# EAGLE design Sensors (EAGLE 7.3.0)
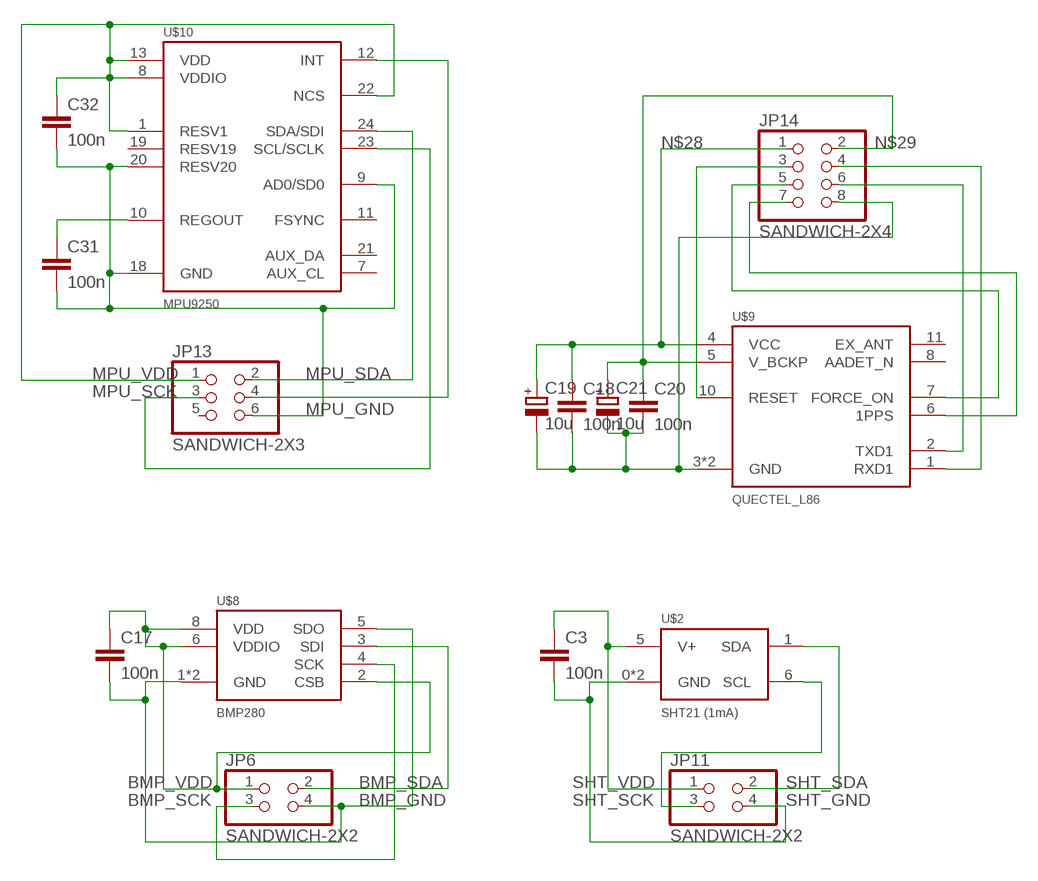
[diagram p0: schematic, sheet 1]

## Parts
C3  100n  C-EUC0805  [C0805]
C17  100n  C-EUC0805  [C0805]
C18  100n  C-EUC0805  [C0805]
C19  10u  CPOL-EUUD-4X5,8  [UD-4X5,8_NICHICON]
C20  100n  C-EUC0805  [C0805]
C21  10u  CPOL-EUUD-4X5,8  [UD-4X5,8_NICHICON]
C31  100n  C-EUC0805  [C0805]
C32  100n  C-EUC0805  [C0805]
JP6  SANDWICH-2X2  [SANDWICH-2X2]
JP11  SANDWICH-2X2  [SANDWICH-2X2]
JP13  SANDWICH-2X3  [SANDWICH-2X3]
JP14  SANDWICH-2X4  [SANDWICH-2X4]
U$2  SHT21 (1mA)  SHT21  [DFN6]
U$8  BMP280  [BMP280]
U$9  QUECTEL_L86  [QUECTEL_L86]
U$10  MPU9250  [QFN-24]

## Nets
BMP_GND: C17.2 JP6.4 U$8.1(GND) U$8.5(SDO) U$8.7(GND)
BMP_SCK: JP6.3 U$8.4(SCK)
BMP_SDA: JP6.2 U$8.3(SDI)
BMP_VDD: C17.1 JP6.1 U$8.2(CSB) U$8.6(VDDIO) U$8.8(VDD)
MPU_GND: C31.2 C32.2 JP13.6 U$10.9(AD0/SD0) U$10.18(GND) U$10.20(RESV20)
MPU_SCK: JP13.3 U$10.23(SCL/SCLK)
MPU_SDA: JP13.2 U$10.24(SDA/SDI)
MPU_VDD: C32.1 JP13.1 U$10.1(RESV1) U$10.8(VDDIO) U$10.13(VDD) U$10.22(NCS)
N$28: C18.1 C19.+ JP14.1 U$9.4(VCC)
N$29: C20.1 C21.+ JP14.2 U$9.5(V_BCKP)
N$35: C31.1 U$10.10(REGOUT)
N$36: JP13.4 U$10.12(INT)
N$37: JP14.3 U$9.10(RESET)
N$38: JP14.6 U$9.2(TXD1)
N$41: JP14.4 U$9.1(RXD1)
N$42: JP14.5 U$9.7(FORCE_ON)
N$43: JP14.7 U$9.6(1PPS)
N$44: C18.2 C19.- C20.2 C21.- JP14.8 U$9.3(GND) U$9.12(GND)
SHT_GND: C3.2 JP11.4 U$2.0(GND) U$2.2(GND)
SHT_SCK: JP11.3 U$2.6(SCL)
SHT_SDA: JP11.2 U$2.1(SDA)
SHT_VDD: C3.1 JP11.1 U$2.5(V+)
Unconnected: JP13.5 U$9.8(AADET_N) U$9.11(EX_ANT) U$10.7(AUX_CL) U$10.11(FSYNC) U$10.19(RESV19) U$10.21(AUX_DA)

## Library data of the parts
C3 C17 C18 C20 C31 C32 = rcl:C-EU: CAPACITOR, European symbol
C19 C21 = rcl:CPOL-EU: POLARIZED CAPACITOR, European symbol
JP6 JP11 = Misc:SANDWICH-2X2
JP13 = Misc:SANDWICH-2X3
JP14 = Misc:SANDWICH-2X4
U$2 = Misc:SHT21: Tempsensor RS No: 709-8868 MRF No: TMP112AIDRLT
U$8 = Misc:BMP280
U$9 = Misc:QUECTEL_L86
U$10 = Misc:MPU9250: 9-axis MotionTracking device that combines a 3-axis gyroscope, 3-axis accelerometer, 3-axis magnetometer and a Digital Motion Processor™ (DMP)

## Board
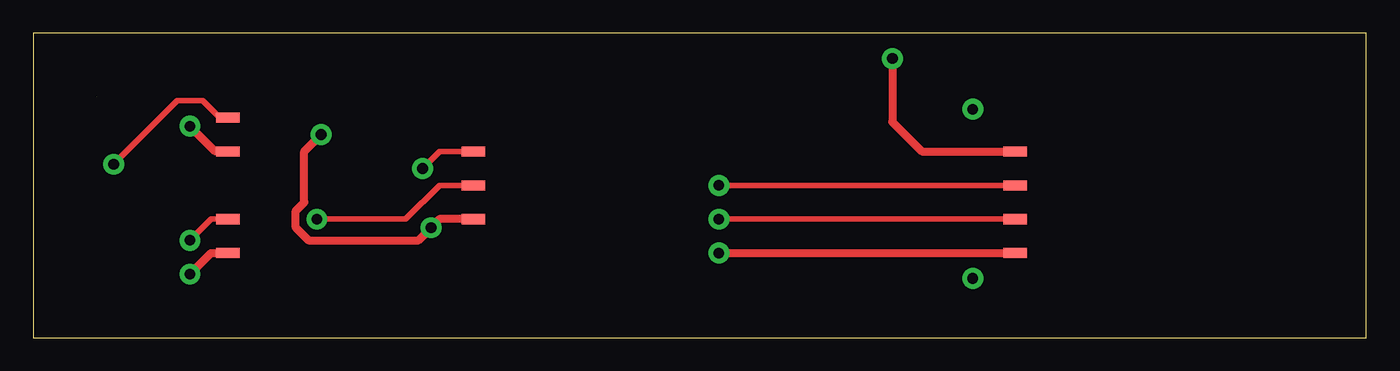
[diagram p1: board, top side]
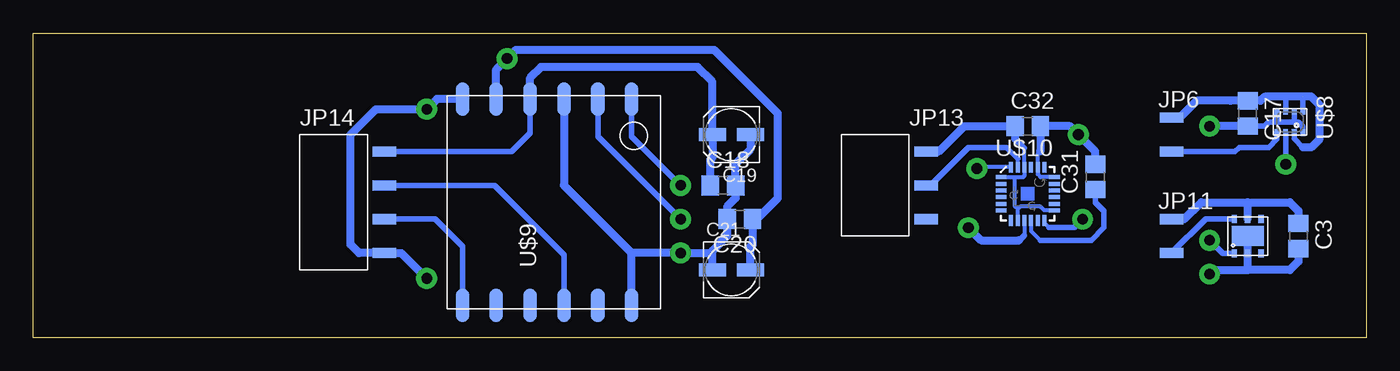
[diagram p2: board, bottom side, seen from below]

Size 100 x 22.85 mm. Coordinates in mm from the lower left corner, seen from the top.
Outline: 0,0 100,0 100,22.85 0,22.85 0,0
Copper layers (1*16): Top 0.035mm / dielectric 1.5mm / Bottom 0.035mm
Design rules "default *": minimum track width 10mil, minimum drill 24mil, track to track 8mil, track to pad 8mil, pad to pad 8mil, via to via 8mil, smd to smd 8mil, copper to edge 40mil, drill to drill 8mil, minimum pad ring 15mil, minimum via ring 15mil, stop-mask expansion 4mil, vias tented up to drill 0mil, thermal gap 10mil

### Footprints (pad centres in the part's own frame; a part is rotated, then mirrored left to right if it is on the bottom)
C0805 = smd 1.3 x 1.5: 1 -0.95,0; 2 0.95,0
UD-4X5,8_NICHICON = smd 2 x 1: + 1.425,0; - -1.425,0
SANDWICH-2X2 = smd 1.778 x 0.762: 1 0,1.27; 3 0,-1.27 | smd 1.778 x 0.762 bottom: 2 0,1.27; 4 0,-1.27
SANDWICH-2X3 = smd 1.778 x 0.762: 1 0,2.54; 3 0,0; 5 0,-2.54 | smd 1.778 x 0.762 bottom: 2 0,2.54; 4 0,0; 6 0,-2.54
SANDWICH-2X4 = smd 1.778 x 0.762: 1 0,3.81; 3 0,1.27; 5 0,-1.27; 7 0,-3.81 | smd 1.778 x 0.762 bottom: 2 0,3.81; 4 0,1.27; 6 0,-1.27; 8 0,-3.81
DFN6 = smd 2.4 x 1.5: 0 0,0 | smd 0.4 x 0.6: 1 -1,-1.3; 2 0,-1.3; 3 1,-1.3; 4 1,1.3; 5 0,1.3; 6 -1,1.3
BMP280 = smd 0.5 x 0.35: 1 0.8,0.975; 2 0.8,0.325; 3 0.8,-0.325; 4 0.8,-0.975; 5 -0.8,-0.975; 6 -0.8,-0.325; 7 -0.8,0.325; 8 -0.8,0.975
QUECTEL_L86 = smd 2.5 x 1: 1 7.75,-5.85; 2 7.75,-3.31; 3 7.75,-0.77; 4 7.75,1.77; 5 7.75,4.31; 6 7.75,6.85; 7 -7.75,6.85; 8 -7.75,4.31; 9 -7.75,1.77; 10 -7.75,-0.77; 11 -7.75,-3.31; 12 -7.75,-5.85
QFN-24 = smd 0.8 x 0.3: 1 -2,1.25; 2 -2,0.75; 3 -2,0.25; 4 -2,-0.25; 5 -2,-0.75; 6 -2,-1.25; 13 2,-1.25; 14 2,-0.75; 15 2,-0.25; 16 2,0.25; 17 2,0.75; 18 2,1.25 | smd 0.3 x 0.8: 7 -1.25,-2; 8 -0.75,-2; 9 -0.25,-2; 10 0.25,-2; 11 0.75,-2; 12 1.25,-2; 19 1.25,2; 20 0.75,2; 21 0.25,2; 22 -0.25,2; 23 -0.75,2; 24 -1.25,2

### Placement (x,y rotation side)
C3  5.08,7.62 270 bottom
C17  8.89,16.83 270 bottom
C18  48.26,11.43 0 bottom
C19  47.62,15.24 180 bottom
C20  46.99,8.89 180 bottom
C21  47.62,5.08 0 bottom
C31  20.32,12.06 90 bottom
C32  25.4,15.88 0 bottom
JP6  14.61,15.24 0 bottom
JP11  14.61,7.62 0 bottom
JP13  33.02,11.43 0 bottom
JP14  73.66,10.16 0 bottom
U$2  8.89,7.62 0 bottom
U$8  5.71,16.19 270 bottom
U$9  60.96,10.16 90 bottom
U$10  25.4,10.79 0 bottom

### Tracks (layer width: path | path; a pad name or v marks a point on that pad's centre or on a via)
BMP_GND  (via drill 0.8)
  Top 0.61: JP6.4 13.65,13.97 v11.75,15.88
  Bottom 0.406: U$8.5 6.69,16.21 6.67,16.19 | 5.4,16.19 5.08,16.19 4.74,15.85 U$8.1 | U$8.7 5.39,16.5 5.4,16.19 | 5.4,16.19 6.67,16.19 | 6.67,16.19 7.3,16.19 7.62,15.88 C17.2
  Bottom 0.61: C17.2 v11.75,15.88
BMP_SCK
  Bottom 0.406: JP6.3 9.84,13.97 9.53,14.29 7.3,14.29 6.69,14.9 U$8.4
BMP_SDA  (via drill 0.8)
  Top 0.406: JP6.2 13.97,16.51 12.7,17.78 10.79,17.78 v6.03,13.02
  Bottom 0.406: U$8.3 v6.04,13.01 v6.03,13.02
BMP_VDD  (1 unrouted)
  Bottom 0.406: U$8.8 4.74,18.1 | U$8.6 6.04,18.09 6.03,18.1 | U$8.2 5.39,14.93 4.75,14.29
  Bottom 0.61: 4.75,14.29 4.13,14.29 3.49,14.92 3.49,17.46 4.13,18.1 4.74,18.1 | JP6.1 13.97,16.51 12.7,17.78 10.16,17.78 C17.1 7.94,17.78 7.62,18.09 6.04,18.09 | 4.76,18.1 6.03,18.1
MPU_GND  (via drill 0.8)
  Top 0.61: v21.59,15.24 20.32,13.97 20.32,10.16 19.68,9.53 19.68,8.26 20.64,7.3 28.89,7.3 v29.84,8.26 30.48,8.89 JP13.6
  Bottom 0.305: 24.45,13.97 24.65,13.77 U$10.20 24.65,12.27 24.43,12.04 U$10.18 | U$10.9 25.65,7.69
  Bottom 0.406: 25.65,7.69 26.04,7.3
  Bottom 0.61: v29.84,8.26 28.89,7.3 26.04,7.3 | 24.45,13.97 C32.2 22.23,15.88 v21.59,15.24 20.32,13.97 C31.2
MPU_SCK
  Bottom 0.305: U$10.23 26.15,13.45
  Bottom 0.406: 26.15,13.45 26.99,14.29 29.84,14.29 32.7,11.43 JP13.3
MPU_SDA  (via drill 0.8)
  Top 0.406: JP13.2 30.48,13.97 v29.21,12.7
  Bottom 0.305: U$10.24 29.11,12.79 v29.21,12.7
MPU_VDD
  Bottom 0.305: 25.65,14.22 U$10.22 25.65,12.13 25.74,12.04 26.35,12.04 | U$10.1 26.35,12.04 | U$10.8 26.15,9.64 | 26.15,9.64 26.35,9.84 26.35,12.04 | U$10.13 24.15,9.54 24.45,9.84 25.95,9.84 26.15,9.64
  Bottom 0.406: 25.65,14.22 26.35,14.92
  Bottom 0.61: JP13.1 32.07,13.97 30.16,15.88 C32.1 26.35,14.93 26.35,14.92
N$28
  Bottom 0.406: U$9.4 62.73,15.38 64.14,13.97 JP14.1
  Bottom 0.61: C18.1 49.21,13.33 49.05,13.49 C19.+ 49.05,19.2 50.16,20.32 61.91,20.32 62.73,19.5 U$9.4
N$29  (via drill 0.8)
  Top 0.61: v64.45,20.95 64.45,16.19 66.67,13.97 JP14.2
  Bottom 0.61: C21.+ 46.2,6.83 46.04,6.99 C20.1 45.72,8.89 44.13,10.48 44.13,16.83 48.9,21.59 63.82,21.59 v64.45,20.95 65.27,20.14 U$9.5
N$35
  Bottom 0.305: U$10.10 25.15,8.01 24.45,7.3
  Bottom 0.406: C31.1 20.32,10.16 19.68,9.53 19.68,8.26 20.64,7.3 24.45,7.3
N$36  (via drill 0.8)
  Top 0.406: v21.27,8.89 27.94,8.89 30.48,11.43 JP13.4
  Bottom 0.305: U$10.12 24.15,8.59 23.81,8.26
  Bottom 0.406: 23.81,8.26 21.91,8.26 v21.27,8.89
N$37
  Bottom 0.406: U$9.10 60.19,6.21 65.41,11.43 JP14.3
N$38  (via drill 0.8)
  Top 0.406: v51.44,8.89 JP14.6
  Bottom 0.406: U$9.2 57.65,15.11 v51.44,8.89
N$41  (via drill 0.8)
  Top 0.406: v51.44,11.43 JP14.4
  Bottom 0.406: U$9.1 55.11,15.11 v51.44,11.43
N$42
  Bottom 0.406: U$9.7 67.81,6.85 69.85,8.89 JP14.5
N$43  (via drill 0.8)
  Bottom 0.61: U$9.6 69.72,17.91 v70.48,17.14 74.3,17.14 76.2,15.24 76.2,6.99 75.56,6.35 JP14.7 72.39,6.35 70.48,4.45
N$44  (via drill 0.8)
  Top 0.61: v51.44,6.35 JP14.8
  Bottom 0.61: U$9.12 55.11,6.35 | U$9.3 60.19,11.43 55.11,6.35 | C19.- 46.2,14.12 47.31,13.02 C18.2 47.31,10.47 47.94,9.84 C20.2 47.94,7.62 49.05,6.51 49.05,6.35 | C21.- 49.05,6.35 | 55.11,6.35 v51.44,6.35 49.05,6.35
N$45  (via drill 0.8)
  other vias: 70.48,4.45
SHT_GND  (via drill 0.8)
  Top 0.61: v11.75,4.76 13.34,6.35 JP11.4
  Bottom 0.61: v11.75,4.76 11.43,5.08 8.89,5.08 | 8.89,5.08 U$2.2 U$2.0 | C3.2 5.08,5.71 5.71,5.08 8.89,5.08
SHT_SCK
  Bottom 0.406: U$2.6 12.04,8.92 JP11.3
SHT_SDA  (via drill 0.8)
  Top 0.406: v11.75,7.3 13.34,8.89 JP11.2
  Bottom 0.406: U$2.1 10.77,6.32 v11.75,7.3
SHT_VDD
  Bottom 0.61: 8.89,10.16 12.38,10.16 13.65,8.89 JP11.1 | 8.89,10.16 5.72,10.16 5.08,9.53 C3.1 | U$2.5 8.89,10.16